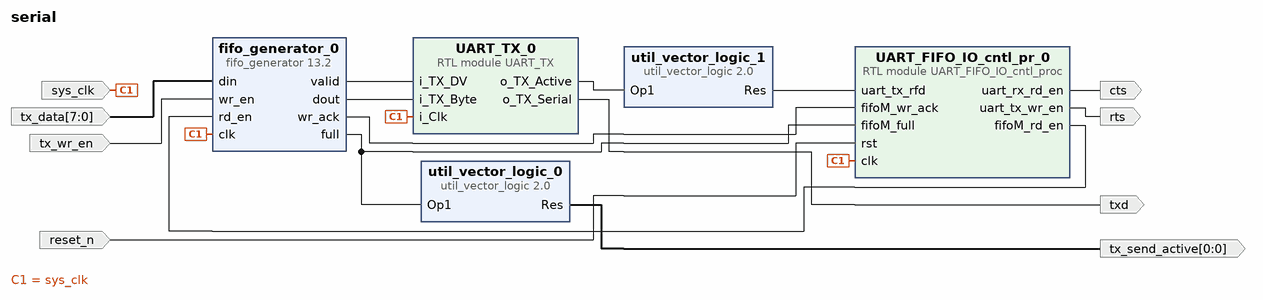
[diagram p0: block diagram of the top level]
# Vivado block design serial, xc7a100tcsg324-1, Vivado 2020.1
create_bd_design serial

create_bd_port -dir I -type clk sys_clk
create_bd_port -dir I -from 7 -to 0 tx_data
create_bd_port -dir I tx_wr_en
create_bd_port -dir O cts
create_bd_port -dir O rts
create_bd_port -dir I -type rst reset_n
create_bd_port -dir O txd
create_bd_port -dir O -from 0 -to 0 tx_send_active

create_bd_cell -type ip -vlnv xilinx.com:ip:fifo_generator:13.2 fifo_generator_0
set_property -dict [list \
  CONFIG.Data_Count true \
  CONFIG.Data_Count_Width 5 \
  CONFIG.Input_Data_Width 8 \
  CONFIG.Input_Depth 32 \
  CONFIG.Output_Data_Width 8 \
  CONFIG.Reset_Pin false \
  CONFIG.Valid_Flag true \
  CONFIG.Write_Acknowledge_Flag true \
] [get_bd_cells fifo_generator_0]
create_bd_cell -type ip -vlnv xilinx.com:ip:util_vector_logic:2.0 util_vector_logic_0
set_property -dict {CONFIG.C_OPERATION not CONFIG.C_SIZE 1} [get_bd_cells util_vector_logic_0]
create_bd_cell -type ip -vlnv xilinx.com:ip:util_vector_logic:2.0 util_vector_logic_1
set_property -dict {CONFIG.C_OPERATION not CONFIG.C_SIZE 1} [get_bd_cells util_vector_logic_1]
create_bd_cell -type module -reference UART_TX UART_TX_0
set_property -dict {CONFIG.g_CLKS_PER_BIT 868} [get_bd_cells UART_TX_0]
create_bd_cell -type module -reference UART_FIFO_IO_cntl_proc UART_FIFO_IO_cntl_pr_0

# ---- connections ----

connect_bd_net [get_bd_pins UART_FIFO_IO_cntl_pr_0/fifoM_rd_en] [get_bd_pins fifo_generator_0/rd_en]
connect_bd_net -net clk_0_1 [get_bd_ports sys_clk] \
  [get_bd_pins fifo_generator_0/clk] [get_bd_pins UART_TX_0/i_Clk] [get_bd_pins UART_FIFO_IO_cntl_pr_0/clk]
connect_bd_net [get_bd_pins fifo_generator_0/wr_ack] [get_bd_pins UART_FIFO_IO_cntl_pr_0/fifoM_wr_ack]
connect_bd_net [get_bd_pins fifo_generator_0/valid] [get_bd_pins UART_TX_0/i_TX_DV]
connect_bd_net [get_bd_pins fifo_generator_0/dout] [get_bd_pins UART_TX_0/i_TX_Byte]
connect_bd_net [get_bd_pins fifo_generator_0/full] [get_bd_pins util_vector_logic_0/Op1] [get_bd_pins UART_FIFO_IO_cntl_pr_0/fifoM_full]
connect_bd_net -net din_0_1 [get_bd_ports tx_data] [get_bd_pins fifo_generator_0/din]
connect_bd_net -net wr_en_0_1 [get_bd_ports tx_wr_en] [get_bd_pins fifo_generator_0/wr_en]
connect_bd_net [get_bd_pins UART_FIFO_IO_cntl_pr_0/uart_rx_rd_en] [get_bd_ports cts]
connect_bd_net [get_bd_pins UART_FIFO_IO_cntl_pr_0/uart_tx_wr_en] [get_bd_ports rts]
connect_bd_net -net rst_0_1 [get_bd_ports reset_n] [get_bd_pins UART_FIFO_IO_cntl_pr_0/rst]
connect_bd_net [get_bd_pins UART_TX_0/o_TX_Serial] [get_bd_ports txd]
connect_bd_net [get_bd_pins util_vector_logic_0/Res] [get_bd_ports tx_send_active]
connect_bd_net [get_bd_pins UART_TX_0/o_TX_Active] [get_bd_pins util_vector_logic_1/Op1]
connect_bd_net [get_bd_pins util_vector_logic_1/Res] [get_bd_pins UART_FIFO_IO_cntl_pr_0/uart_tx_rfd]

validate_bd_design
save_bd_design
